# Altium schematic sheet Filters.SchDoc
size A4; SheetNumber: 3; SheetTotal: 4
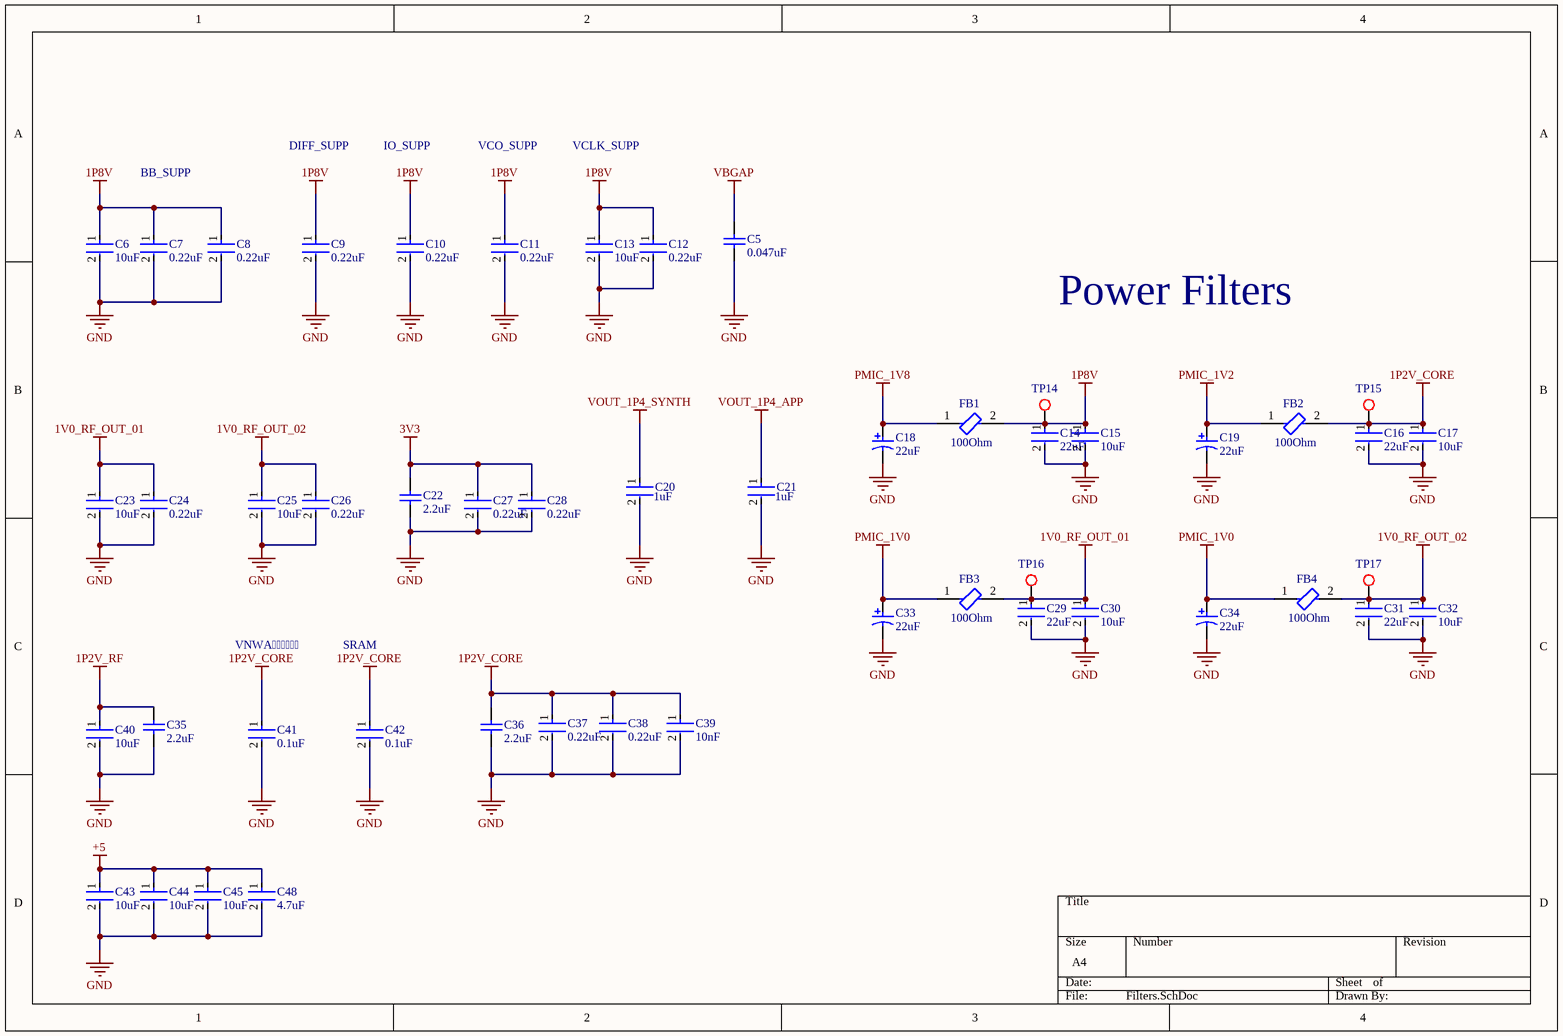
[diagram p0: Filters.SchDoc]

## Parts
C5  0.047uF  [CAPC1608X90X35NL15T15]
C6  10uF  [FP-GRM18-0_15-MFG]
C7  0.22uF  [FP-C0603C-CF-MFG]
C8  0.22uF  [FP-C0603C-CF-MFG]
C9  0.22uF  [FP-C0603C-CF-MFG]
C10  0.22uF  [FP-C0603C-CF-MFG]
C11  0.22uF  [FP-C0603C-CF-MFG]
C12  0.22uF  [FP-C0603C-CF-MFG]
C13  10uF  [FP-GRM18-0_15-MFG]
C14  22uF  [FP-CL21-IPC_C]
C15  10uF  [FP-GRM18-0_15-MFG]
C16  22uF  [FP-CL21-IPC_C]
C17  10uF  [FP-GRM18-0_15-MFG]
C18  22uF  [NIC-CAPA2-4X5.8_V]
C19  22uF  [NIC-CAPA2-4X5.8_V]
C20  1uF  [FP-CL10-IPC_C]
C21  1uF  [FP-CL10-IPC_C]
C22  2.2uF  [CAPC0603(1608)100_N]
C23  10uF  [FP-GRM18-0_15-MFG]
C24  0.22uF  [FP-C0603C-CF-MFG]
C25  10uF  [FP-GRM18-0_15-MFG]
C26  0.22uF  [FP-C0603C-CF-MFG]
C27  0.22uF  [FP-C0603C-CF-MFG]
C28  0.22uF  [FP-C0603C-CF-MFG]
C29  22uF  [FP-CL21-IPC_C]
C30  10uF  [FP-GRM18-0_15-MFG]
C31  22uF  [FP-CL21-IPC_C]
C32  10uF  [FP-GRM18-0_15-MFG]
C33  22uF  [NIC-CAPA2-4X5.8_V]
C34  22uF  [NIC-CAPA2-4X5.8_V]
C35  2.2uF  [CAPC0603(1608)100_N]
C36  2.2uF  [CAPC0603(1608)100_N]
C37  0.22uF  [FP-C0603C-CF-MFG]
C38  0.22uF  [FP-C0603C-CF-MFG]
C39  10nF  [FP-CGA3E-0_3-0_1-IPC_A]
C40  10uF  [FP-GRM18-0_15-MFG]
C41  0.1uF  [FP-CC0603-DA-MFG]
C42  0.1uF  [FP-CC0603-DA-MFG]
C43  10uF  [FP-GRM18-0_15-MFG]
C44  10uF  [FP-GRM18-0_15-MFG]
C45  10uF  [FP-GRM18-0_15-MFG]
C48  4.7uF  [FP-CL10-IPC_A]
FB1  100Ohm  [FP-MPZ1608-0_8-MFG]
FB2  100Ohm  [FP-MPZ1608-0_8-MFG]
FB3  100Ohm  [FP-MPZ1608-0_8-MFG]
FB4  100Ohm  [FP-MPZ1608-0_8-MFG]
TP14  TP_1  [Testpoint]  (value not drawn)
TP15  TP_1  [Testpoint]  (value not drawn)
TP16  TP_1  [Testpoint]  (value not drawn)
TP17  TP_1  [Testpoint]  (value not drawn)

## Nets
1P2V_CORE: C16.1 C17.1 C36.2 C37.1 C38.1 C39.1 C41.1 C42.1 FB2.2 TP15.0
1P2V_RF: C35.2 C40.1
1P8V: C6.1 C7.1 C8.1 C9.1 C10.1 C11.1 C12.1 C13.1 C14.1 C15.1 FB1.2 TP14.0
1V0_RF_OUT_01: C23.1 C24.1 C29.1 C30.1 FB3.2 TP16.0
1V0_RF_OUT_02: C25.1 C26.1 C31.1 C32.1 FB4.2 TP17.0
3V3: C22.2 C27.1 C28.1
+5: C43.1 C44.1 C45.1 C48.1
GND: C5.1 C6.2 C7.2 C8.2 C9.2 C10.2 C11.2 C12.2 C13.2 C14.2 C15.2 C16.2 C17.2 C18.2 C19.2 C20.2 C21.2 C22.1 C23.2 C24.2 C25.2 C26.2 C27.2 C28.2 C29.2 C30.2 C31.2 C32.2 C33.2 C34.2 C35.1 C36.1 C37.2 C38.2 C39.2 C40.2 C41.2 C42.2 C43.2 C44.2 C45.2 C48.2
PMIC_1V0: C33.1 C34.1 FB3.1 FB4.1
PMIC_1V2: C19.1 FB2.1
PMIC_1V8: C18.1 FB1.1
VBGAP: C5.2
VOUT_1P4_APP: C21.1
VOUT_1P4_SYNTH: C20.1

## Notes on the sheet
- BB_SUPP
- DIFF_SUPP
- IO_SUPP
- VCO_SUPP
- VCLK_SUPP
- Power Filters
- VNWA
- SRAM

## Library data of the parts
C5 = CMP-2006-02145-1: Manufacturer: AVX Interconnect / Elco; Part Number: 06035F473K4T2A
C6 C13 C15 C17 C23 C25 C30 C32 C40 C43-C45 = CMP-2000-05448-2: CAP CER 10UF 10V X5R 0603; Manufacturer Part Number: GRM188R61A106KE69D; Manufacturer: Murata; Temperature Coefficient: 15%; Material: Ceramic; Tolerance: 10%; Device Class L1: Passive Components; ComponentLink2Description: Datasheet; Height: 0.95mm; Package: GRM18-0.15; Octopart: https://octopart.com/grm188r61a106ke69d-murata-22851381; Value: 10uF; Digikey Description: CAP CER 10UF 10V X5R 0603; Temperature Range High: +85°C; Temperature Range Low: -55°C; Temperature Characteristic: X5R; Capacitance: 10uF; RoHS: TRUE; Device Class L2: Capacitors; ComponentLink2URL: https://search.murata.co.jp/Ceramy/image/img/A01X/G101/ENG/GRM188R61A106KE69-01A.pdf; Device Class L3: Ceramic Capacitors; Lead Free: Yes; Mouser Description: Multilayer Ceramic Capacitors MLCC - SMD/SMT 0603 10uF 10volts X5R + - 10%; Category: Cap; Voltage Rating: 10V; Temperature: -55°C to +85°C; Automotive: No
C7-C12 C24 C26-C28 C37 C38 = CMP-03020-026996-1: C0603 0.22 μF X7R 30ppm/°C 10.00% 10 V; Manufacturer Part Number: C0603C224K8RAC; Manufacturer: KEMET; Capacitance: 0.22 μF; Automotive Grade: Grade 1; Material: Ceramic; Value: 0.22 μF; Voltage Rating: 10 V; Tolerance: 0.1; Device Class L2: Capacitors; Temperature Range High: +125°C; RoHS: TRUE; Device Class L1: Passive Components; Temperature: -55°C to +125°C; Temperature Coefficient: 30ppm/°C; ComponentLink2Description: Datasheet; Device Class L3: Ceramic Capacitors; ComponentLink2URL: https://api.kemet.com/component-edge/download/datasheet/C0603C100J5GACAUTO.pdf; Category: Cap; Lead Free: Yes; Automotive: Yes; Height: 0.87mm; Temperature Characteristic: X7R; Mouser Description: Multilayer Ceramic Capacitors MLCC - SMD/SMT 50volts 0.22 uF C0G X7R; Octopart: https://octopart.com/c0603c224k8rac-kemet-7455784; Package: C0603C-CF; Temperature Range Low: -55°C
C14 C16 C29 C31 = CMP-13271-003019-1: CL21 Series 0805 22uF 4V ±20% Tolerance X6S Multilayer Ceramic Chip Capacitor; Capacitance: 22uF; Packaging: Tape and Reel; Depth: 1.25mm; Mount: Surface Mount; Width: 0.049inch; Min Operating Temperature: -55°C; Case/Package: 0805; Max Operating Temperature: 105°C; Package Quantity: 1; Case Code (Metric): 2012; Voltage Rating: 4V; Radiation Hardening: No; Dielectric: X6S; Thickness: 0.055inch; Case Code (Imperial): 0805; Length: 2mm; Tolerance: 20%; Height: 1.25mm
C18 C19 C33 C34 = CMP-0687-00010-1: Aluminum Electrolytic Capacitor, UD Series, Low Impedance, 22 uF, 10 V, + / - 20%, -55 to 105 degC, Chip Type, 4 x 5.8 mm D x L, Pb-Free, Reel; Manufacturer: Nichicon; PartNumber: UUD1A220MCL1GS; Endurance Time: 2000 h; Packing: Dia382mm Reel; Tolerance Rated Capacitance: -20 to 20%; Rated Ripple Current (at 100kHz): 80 mA; Impedance: 1.8 Ohm; Rated Voltage: 10 V; ComponentLink3URL: http://products.nichicon.co.jp/en/pdf/XJA043/e-ud.pdf; ComponentLink2URL: http://products.nichicon.co.jp/en/pdf/XJA043/e-ud.pdf; ComponentLink2Description: Datasheet; ComponentLink1URL: http://www.nichicon.co.jp/; DatasheetVersion: 08/2012; PackageDescription: 2-Pin Surface Mount Device, Diameter 4 mm, Height 5.8 mm, Pitch 3.6 mm; PackageReference: CAPAE-D4H5.8; ComponentLink1Description: Manufacturer URL; Rated Capacitance: 22 uF; Length: 5.8 mm; Diameter: 4 mm; ComponentLink3Description: Package Specification; Mounting Technology: Surface Mount; RoHS: TRUE
C20 C21 = CMP-13271-003399-1: Cap Ceramic 1uF 10V X5R ±10% Pad SMD 0603 +85°C T/R; Min Operating Temperature: -55°C; Max Operating Temperature: 85°C; Dielectric: X5R; Contact Plating: Tin; Height: 0.8mm; Voltage: 10V; Packaging: Tape and Reel; Voltage Rating: 10V; Capacitance: 1uF; Package Quantity: 1; Width: 0.031inch; Length: 1.6mm; Depth: 0.8mm; Case/Package: 0603; Case Code (Imperial): 0603; Thickness: 0.035inch; Radiation Hardening: No; Tolerance: 10%; Case Code (Metric): 1608; Mount: Surface Mount
C22 C35 C36 = CMP-1035-02766-1: CAP 2.2uF 16V -20% to +80% 0603 (1608 Metric) Thickness 1mm SMD; Case-Metric: 1608; Case-EIA: 0603; Value: 2.2uF; Rated Voltage: 16 V; Tolerance: -20% to +80%; Technology: SMT; Max Thickness: 1 mm
C39 = CMP-08246-000769-1: Cap Ceramic 10nF 100V X8R 10% Pad SMD 0603 +150°C Automotive T/R; Mount: Surface Mount; Voltage Rating (DC): 100V; Termination: SMD/SMT; Dielectric: X8R; Case/Package: 0603; Ratings: AEC-Q200; Voltage Rating: 100V; Capacitance: 10nF; Packaging: Tape and Reel; Thickness: 0.035inch; Composition: Ceramic; Max Operating Temperature: 150°C; Width: 0.031inch; Height: 0.8mm; Weight: 7.1E-05oz; Depth: 0.8mm; Min Operating Temperature: -55°C; Length: 1.6mm; Case Code (Metric): 1608; Tolerance: 10%; Package Quantity: 4000; Case Code (Imperial): 0603
C41 C42 = CMP-03422-001228-1: CAP CER 0.1UF 10V X7R 0603; Manufacturer Part Number: CC0603KRX7R6BB104; Manufacturer: YAGEO; Material: Ceramic; Tolerance: 0.1; Capacitance: 100 nF; Temperature Coefficient: 15%; Value: 100 nF; Height: 0.9mm; RoHS: TRUE; Footprint Url: http://www.yageo.com/exep/pages/download/literatures/UPY-C_GEN_24.pdf; Octopart: https://octopart.com/cc0603krx7r6bb104-yageo-9291607; Device Class L1: Passive Components; Mouser Description: 0603 0.1 uF 10 V ±10 % Tolerance X7R SMT Multilayer Ceramic Capacitor; ComponentLink2URL: http://www.yageo.com/documents/recent/UPY-GPHC_X7R_6.3V-to-50V_18.pdf; Automotive: No; Voltage: 10 V; Device Class L3: Ceramic Capacitors; Category: Cap; Temperature: -55°C to +125°C; ComponentLink2Description: Datasheet; Voltage Rating: 10 V; Device Class L2: Capacitors; Lead Free: Yes; Temperature Range High: +125°C; Temperature Range Low: -55°C; Digikey Description: CAP CER 0.1UF 10V X7R 0603; Package: CC0603-DA; Temperature Characteristic: X7R
C48 = CMP-13271-001817-1: Cap Ceramic 4.7uF 6.3V X6S ±10% Pad SMD 0603 +105°C T/R; Length: 1.6mm; Tolerance: 10%; Packaging: Tape and Reel; Dielectric: X6S; Lead Free: Lead Free; Package Quantity: 1; Case/Package: 0603; Max Operating Temperature: 105°C; Radiation Hardening: No; Thickness: 0.035inch; Depth: 0.8mm; Capacitance: 4.7uF; Case Code (Metric): 1608; Voltage Rating (DC): 6.3V; Height: 0.8mm; Voltage Rating: 6.3V; Mount: Surface Mount; Min Operating Temperature: -55°C; Case Code (Imperial): 0603; Width: 0.031inch
FB1-FB4 = CMP-08257-000073-1: Power line Ferrite Bead 100Ω @ 100MHz 2A DCR 0.04Ω AEC-Q200 SMD 0603; Impedance: 100R; Tolerance: 25%; Number of Lines: 1; DC Resistance (DCR): 40mR; Termination: SMD/SMT; Case Code (Imperial): 0603; RoHS Compliant: Yes; Weight: 7.1E-05oz; Case Code (Metric): 1608; Width: 0.031inch; Max DC Current: 2A; Mount: Surface Mount; Packaging: Tape and Reel; Package Quantity: 4000; Length: 0.063inch; Max Current Rating: 2A; Min Operating Temperature: -55°C; Max Operating Temperature: 125°C; Case/Package: 0603; Height: 0.037inch; Test Frequency: 100MHz; Ratings: AEC-Q200
TP14-TP17 = Testpoint